# Altium schematic sheet PowerManagement_Driver.SchDoc: Power Management Driver
size A3; DrawnBy: Fabian Niederberger; Engineer: Fabian Niederberger; Organization: HSLU T&A; Address1: Abteilung Elektrotechnik; Address2: Technikumsstrasse 21; Address3: CH-6048 Horw; DocumentNumber: 3; Revision: 1.0; SheetNumber: 3; SheetTotal: 3; Projektname: PREN2 Team 10; pcbDesigner: Fabian Niederberger; DocumentName: Power Management Driver; ProjectName: PREN2 Team 10
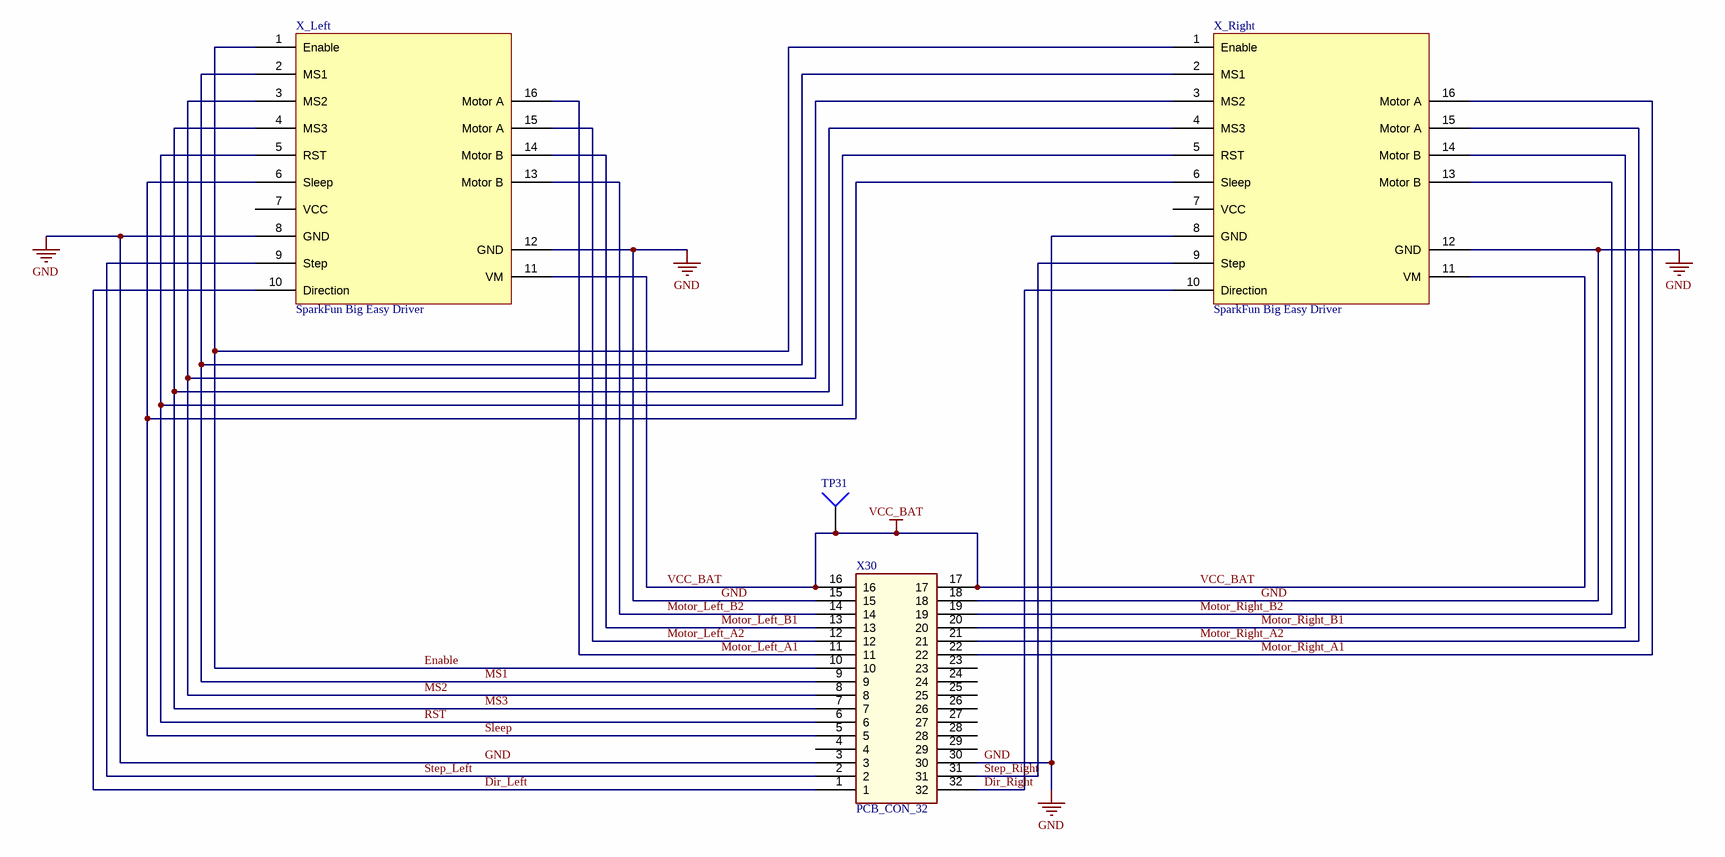
[diagram p0: PowerManagement_Driver.SchDoc]

## Parts
TP31  (no value)  [PIN1]
X30  PCB_CON_32  [PCB_CON_32_PLUG]
X_Left  SparkFun Big Easy Driver  [SPARKFUN_BIG_EASY_DRIVER]
X_Right  SparkFun Big Easy Driver  [SPARKFUN_BIG_EASY_DRIVER]

## Nets
GND: X30.3 X30.15 X30.18 X30.30 X_Left.8(GND) X_Left.12(GND) X_Right.8(GND) X_Right.12(GND)
VCC_BAT: TP31.1 X30.16 X30.17 X_Left.11(VM) X_Right.11(VM)
Dir_Left: X30.1 X_Left.10(Direction)
Dir_Right: X30.32 X_Right.10(Direction)
Enable: X30.10 X_Left.1(Enable) X_Right.1(Enable)
Motor_Left_A1: X30.11 X_Left.16(Motor_A)
Motor_Left_A2: X30.12 X_Left.15(Motor_A)
Motor_Left_B1: X30.13 X_Left.14(Motor_B)
Motor_Left_B2: X30.14 X_Left.13(Motor_B)
Motor_Right_A1: X30.22 X_Right.16(Motor_A)
Motor_Right_A2: X30.21 X_Right.15(Motor_A)
Motor_Right_B1: X30.20 X_Right.14(Motor_B)
Motor_Right_B2: X30.19 X_Right.13(Motor_B)
MS1: X30.9 X_Left.2(MS1) X_Right.2(MS1)
MS2: X30.8 X_Left.3(MS2) X_Right.3(MS2)
MS3: X30.7 X_Left.4(MS3) X_Right.4(MS3)
RST: X30.6 X_Left.5(RST) X_Right.5(RST)
Sleep: X30.5 X_Left.6(Sleep) X_Right.6(Sleep)
Step_Left: X30.2 X_Left.9(Step)
Step_Right: X30.31 X_Right.9(Step)

Not connected (* = marked no-connect by the designer): X30 4 23 24 25 26 27 28 29; X_Left 7(VCC); X_Right 7(VCC)

## Notes on the sheet
- Project:
- Drawn by:
- Size:
- Sheet
- A3
- Rev.:
- of
- Date:
- File:

## Library data of the parts
TP31 = Socket: LatestRevisionDate: 17-Jul-2002; LatestRevisionNote: Re-released for DXP Platform.; Publisher: Altium Limited
X30 = PCB_CON_32: Connects a PCB with another. This scheme is either jack or plug, depends on footprint
X_Left X_Right = SparkFun Big Easy Driver: Stepper Motor Driver with 4 wires